# Altium schematic sheet Battery.SchDoc
size A; SheetNumber: 2; SheetTotal: 3
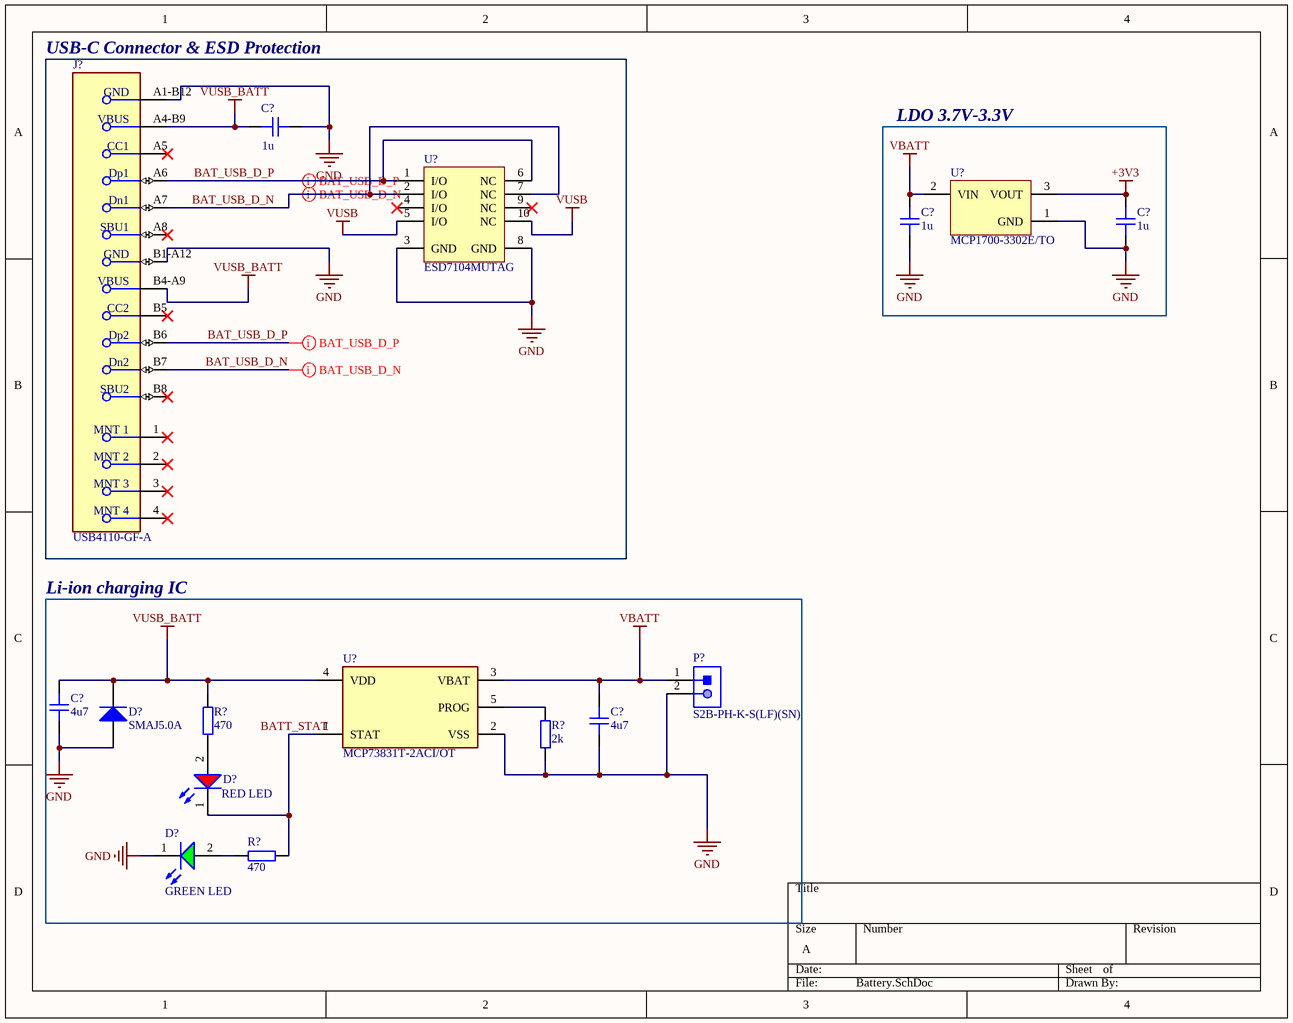
[diagram p0: Battery.SchDoc]

## Parts
(Parts that share a designator on the sheet are numbered #1, #2 ... from top to bottom, then left to right.)
C?#1  1u  [CAP_0603]
C?#2  1u  [CAP_0603]
C?#3  1u  [CAP_0603]
C?#4  4u7  [CAP_0603]
C?#5  4u7  [CAP_0603]
D?#1  SMAJ5.0A  [BOUR-SMA-2_V]
D?#2  RED LED  [WL-SMCW_0603_150060xx75000]
D?#3  GREEN LED  [WL-SMCW_0603_150060xx75000]
J?  USB4110-GF-A  [FP-USB4110-GF-A-MFG]
P?  S2B-PH-K-S(LF)(SN)  [JST-S2B-PH-K-S_V]
R?#1  470  [RES_0603]
R?#2  2k  [RES_0603]
R?#3  470  [RES_0603]
U?#1  ESD7104MUTAG  [ONSC-UDFN-10-517BB-01_V]
U?#2  MCP1700-3302E/TO  [TO-92-TO3]
U?#3  MCP73831T-2ACI/OT  [FP-C04-091-OT-IPC_B]

## Blocks framed on the sheet
USB-C Connector & ESD Protection: C?#1 J? U?#1
LDO 3.7V-3.3V: C?#2 C?#3 U?#2
Li-ion charging IC: C?#4 C?#5 D?#1-D?#3 P? R?#1-R?#3 U?#3

## Nets
+3V3: C?#3.2 U?#2.3(VOUT)
GND: C?#1.2 C?#2.1 C?#3.1 C?#4.1 C?#5.1 D?#1.1(A) D?#3.1(K) J?.A1-B12(GND) J?.B1-A12(GND) P?.2 R?#2.1 U?#1.3(GND) U?#1.8(GND) U?#2.1(GND) U?#3.2(VSS)
VBATT: C?#2.2 C?#5.2 P?.1 U?#2.2(VIN) U?#3.3(VBAT)
VUSB: U?#1.5(I/O) U?#1.10(NC)
VUSB_BATT: C?#1.1 C?#4.2 D?#1.2(K) J?.A4-B9(VBUS) J?.B4-A9(VBUS) R?#1.2 U?#3.4(VDD)
BAT_USB_D_N: J?.A7(Dn1) J?.B7(Dn2) U?#1.2(I/O) U?#1.7(NC)
BAT_USB_D_P: J?.A6(Dp1) J?.B6(Dp2) U?#1.1(I/O) U?#1.6(NC)
NetD?#2_1: D?#2.1(K) R?#3.2 U?#3.1(STAT)
NetD?#2_2: D?#2.2(A) R?#1.1
NetD?#3_2: D?#3.2(A) R?#3.1
NetR?#2_2: R?#2.2 U?#3.5(PROG)

Not connected (* = marked no-connect by the designer): J? 1(MNT_1)* 2(MNT_2)* 3(MNT_3)* 4(MNT_4)* A5(CC1)* A8(SBU1)* B5(CC2)* B8(SBU2)*; U?#1 4(I/O)* 9(NC)*

## Layout directives
differential pair: BAT_USB_D_N, BAT_USB_D_P

## Notes on the sheet
- Labels drawn without touching a wire or pin: BATT_STAT

## Library data of the parts
C?#1-C?#5 = CAP_0603: Capacitor SMD 0603; Manufacturer: *; Manufacturer Part Number: *; Distributor Link: *; LCSC: *; Rating: *; Dielectric: *
D?#1 = CMP-2000-07090-1: SMAJ Transient Voltage Suppressor Diode Series, 3.5 V, -55 to 150 degC, 2-Pin SMA, RoHS, Tape and Reel; Manufacturer: Bourns; EDA / CAD Models: DownloadfromAcceleratedDesigns; Unidirectional Channels: 1; Voltage - Breakdown (Min): 6.4V; Voltage - Reverse Standoff (Typ): 5V; Voltage - Clamping (Max) @ Ipp: 9.2V; Other Names: SMAJ5.0ABDKR; Type: Zener; Catalog Drawings: SMAJSeriesFootprintSMAJ,SMBJSeries; Featured Product: SMAJ/SMBJ/SMCJ/SMLJDiscreteTVSDiodes; Power - Peak Pulse: 400W; Current - Peak Pulse (10/1000µs): 43.5A; Power Line Protection: No; Online Catalog: SMAJSeries; Supplier Device Package: SMA(DO-214AC); Operating Temperature: -55°C~150°C(TJ); Package Description: 2-Pin Surface Mount Device, Body 4.315 x 2.605 mm; Datasheet URL: https://datasheet.ciiva.com/25624/0900766b8112213b-25624680.pdf; Manufacturer URL: http://www.bourns.com/; Datasheet Version: 08/2012; Series: SMAJ; Family: TVS-Diodes; Bidirectional Channels: -; Applications: GeneralPurpose; Package Reference: SMA-2; Standard Package: 1; Package / Case: DO-214AC,SMA; Category: CircuitProtection; RoHS Information: SMAJSeriesMaterialDeclaration; Mounting Technology: SurfaceMount; Capacitance @ Frequency: -; Packaging: Digi-Reel®; Mounting Type: SurfaceMount
D?#2 = CMP-007-00045-2: Single Color LED, Red, Water Clear, 1.1mm; Forward Current: 30mA; Min Operating Temperature: -40°C; Max Operating Temperature: 85°C; Mounting Technology: Surface Mount; Pins: 2; RoHS Compliant: Yes
D?#3 = CMP-007-00046-2: Single Color LED, Green, Water Clear, 1.1mm; Forward Current: 30mA; Pins: 2; Mounting Technology: Surface Mount; Max Operating Temperature: 85°C; RoHS Compliant: Yes; Min Operating Temperature: -40°C
J? = CMP-245163-000002-1: CONN USB 2.0 TYPE-C R/A SMT; Manufacturer: GCT; Conn Orientation: Right Angle; Usb Standard: USB 2.0; Voltage Rating: 20V; Current Rating: 3/4.25/1.25/0.25A; Number Of Contacts: 16; Is Female: yes; Shielding: true; Standoff Height: 0.1mm; Octopart: https://octopart.com/usb4110-gf-a-gct-103941985; Temperature: -40°C to +85°C; RoHS: TRUE; Automotive: No; Contact Material: Gold,Nickel; Device Class L1: Connectors; Device Class L2: USB Connectors; Package: 0; Lead Free: Yes; ComponentLink2URL: https://gct.co/files/drawings/usb4110.pdf; Temperature Range High: +85°C; Temperature Range Low: -40°C; Height: 3.46mm; Manufacturer Part Number: USB4110-GF-A; ComponentLink2Description: Datasheet; Device Class L3: unset; Digikey Description: CONN USB 2.0 TYPE-C R/A SMT; Category: Conn
P? = CMP-1755-00004-1: Male Header, Pitch 2 mm, 1 x 2 Position, Height 4.8 mm, Tail Length 3.4 mm, -25 to 85 degC, RoHS, Bulk; Case\Package: Radial; Tolerance: 20%; Capacitance: 10 uF; Voltage Rating (DC): 50 V; Packaging: Bulk; ComponentLink1URL: http://www.jst-mfg.com/product/pdf/eng/ePH.pdf; Radiation Hardening: No; Height: 11 mm; Package Quantity: 200; PackageDescription: Male Header, Pitch 2 mm, 1 x 2 Position, Height 4.8 mm, Tail Length 3.4 mm; PackageReference: S2B-PH-K-S; Diameter: 5 mm; Pins: 2; Mount: Through Hole; Max Operating Temperature: 85 degC; Min Operating Temperature: -40 degC; ComponentLink1Description: Datasheet; DatasheetVersion: Dec-12; Length: 11 mm; Lead Pitch: 2 mm; REACH SVHC: No SVHC; Voltage Rating: 50 V; RoHSCompliant: true
R?#1-R?#3 = RES_0603: Resistor SMD 0603; Manufacturer: *; Manufacturer Part Number: *; Distributor Link: *; LCSC: *
U?#1 = CMP-1063-00242-1: Transient Voltage Suppressor, Low Capacitance ESD Protection for High Speed Data, 10-Pin UDFN, Pb-Free, Tape and Reel; Manufacturer: On Semiconductor; IR Max (uA): 1; Number of Lines: 4; VRWM Max (V): 5; Direction: Bidirectional; V(BR) Min (V): 5.5; PackageDescription: 10-Pin Small Outline No-Lead, Body 2.5 x 1 mm, Pitch 0.5 mm; ComponentLink3URL: http://www.onsemi.com/pub_link/Collateral/517BB.PDF; PackageReference: UDFN-10-517BB-01; Mounting Technology: Surface Mount; PartNumber: ESD7104MUTAG; ComponentLink1URL: http://www.onsemi.com/; ComponentLink1Description: Manufacturer URL; DatasheetVersion: Rev. 2; ComponentLink2Description: Datasheet; ComponentLink2URL: http://www.onsemi.cn/pub_link/Collateral/ESD7104-D.PDF; PackageVersion: Rev. O, 11/2009; Packing: Tape and Reel; RoHS: Pb-Free; ComponentLink3Description: Package Specification
U?#2 = CMP-0136-00007-1: Low Quiescent Current LDO, 3-Pin TO-92, Extended TemperatureBAG; PackageReference: TO-92-TO3; PackageDescription: 3-Lead Plastic Transistor Outline (TO) [TO-92]; DatasheetVersion: revB, Feb-2007; PackageVersion: revBB, Aug-2009
U?#3 = CMP-0133-00143-2: IC CONTROLLR LI-ION 4.2V SOT23-5; Max Power Dissipation: 1.54W; Output Current: 500mA; Max Output Voltage: 4.5V; Number of Outputs: 1; Min Output Voltage: 4.168V; Min Supply Voltage: 3.75V; Max Input Voltage: 6V; Voltage Rating: 4.534V; Drain to Source Resistance: 350mR; Max Operating Temperature: 85°C; Length: 0.122inch; Number of Pins: 5; REACH SVHC: No SVHC; Radiation Hardening: No; Min Operating Temperature: -40°C; Weight: 0.00709oz; Contact Plating: Tin; Termination: SMD/SMT; Case/Package: SOT-23; Mount: Surface Mount; Width: 0.071inch; Packaging: Tape and Reel; Number of Cells: 1; Max Charge Current: 500mA; Height: 0.051inch; Number of Channels: 1; Output Voltage: 4.2V; Max Supply Voltage: 6V; Lead Free: Lead Free